# Altium schematic sheet Mainboard.SchDoc
size A4; SheetNumber: 1; SheetTotal: 2
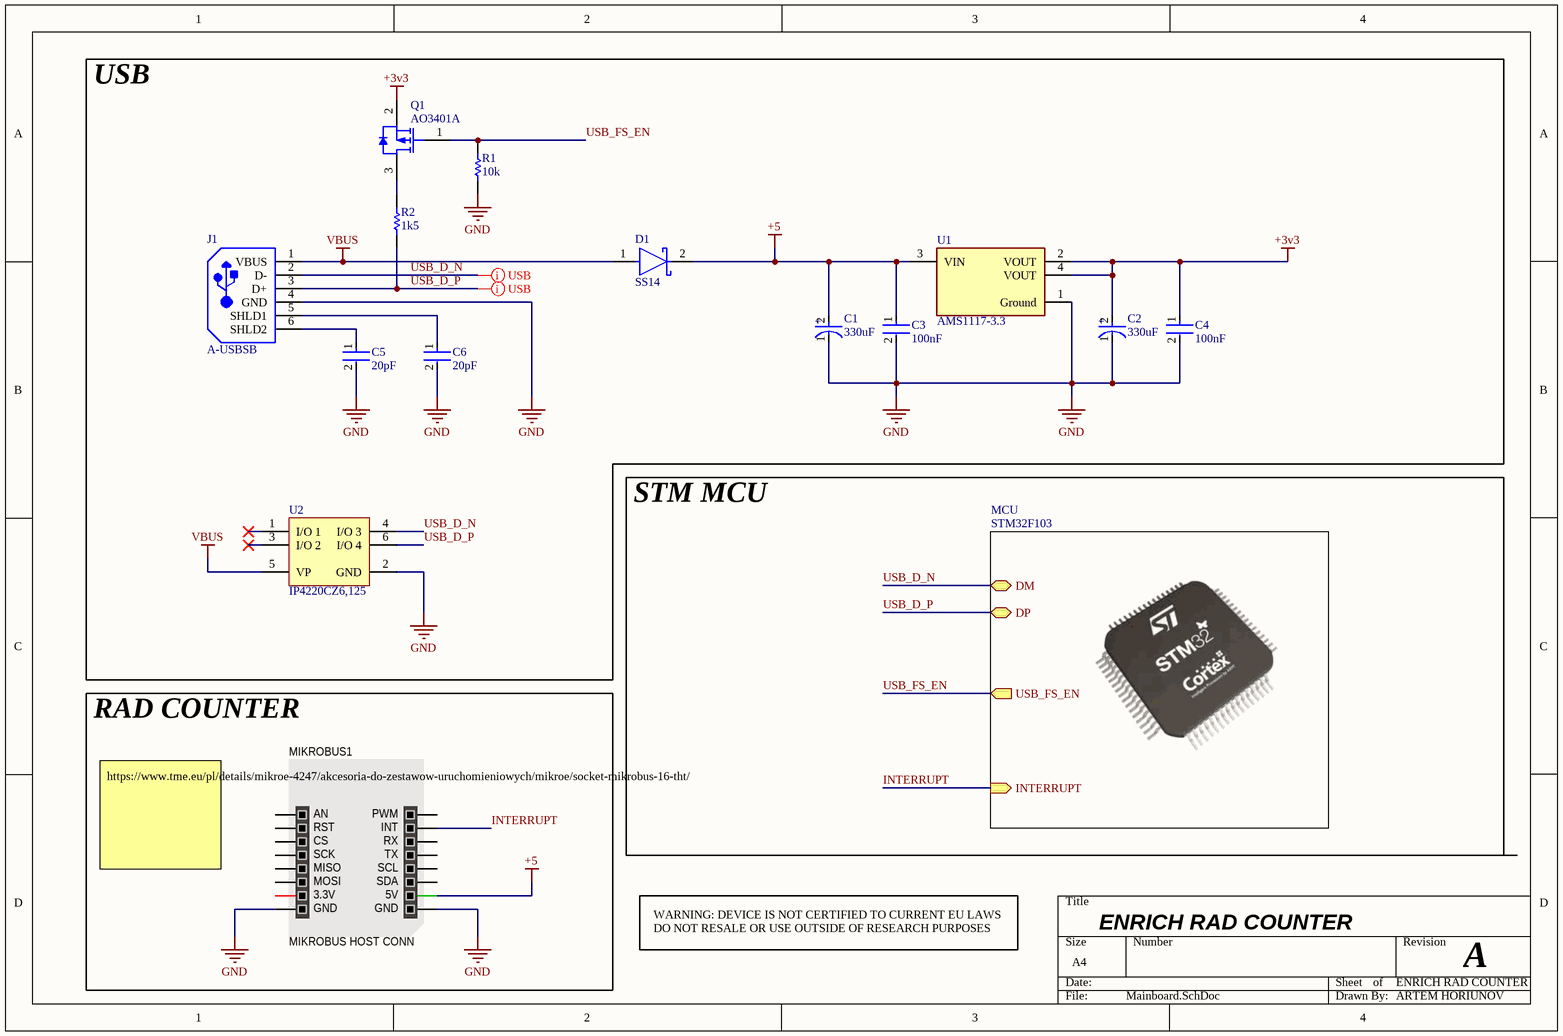
[diagram p0: Mainboard.SchDoc]

## Parts
C1  330uF  [FP-OS-CON-SMT-F12-MFG]
C2  330uF  [FP-OS-CON-SMT-F12-MFG]
C3  100nF  [FP-C0402-BB-MFG]
C4  100nF  [FP-C0402-BB-MFG]
C5  20pF  [FP-C0603C-CF-MFG]
C6  20pF  [FP-C0603C-CF-MFG]
D1  SS14  [FP-403AE-MFG]
J1  A-USBSB  [ASSM-A-USBSB-4_V]
MIKROBUS1  MIKROBUS HOST CONN  [MIKROBUS HOST CONN 8gen TH]
Q1  AO3401A  [AO-SOT-23-3L_V]
R1  10k  [RESC1609X50X30NL8T20]
R2  1k5  [RESC1608X55X30ML15T15]
U1  AMS1117-3.3  [FP-AMS1117-IPC_C]
U2  IP4220CZ6,125  [NXP-SOT457_L]

## Blocks framed on the sheet
USB: C1-C6 D1 J1 Q1 R1 R2 U1 U2
RAD COUNTER: MIKROBUS1

## Sub-sheets
MCU = STM32F103: DM (bidir), DP (bidir), INTERRUPT (in), USB_FS_EN (out)

## Nets
+3v3: C2.2(A) C4.1 Q1.2(SOURCE) U1.2(VOUT) U1.4(VOUT)
+5: C1.2(A) C3.1 D1.2(C) MIKROBUS1.10(5V) U1.3(VIN)
GND: C1.1(C) C2.1(C) C3.2 C4.2 C5.2 C6.2 J1.4(GND) MIKROBUS1.8(GND) MIKROBUS1.9(GND) R1.2 U1.1(Ground) U2.2(GND)
VBUS: D1.1(A) J1.1(VBUS) U2.5(VP)
INTERRUPT: MIKROBUS1.15(INT) ; sheet MCU/INTERRUPT
USB_D_N: J1.2(D-) U2.4(I/O_3) ; sheet MCU/DM
USB_D_P: J1.3(D+) R2.1 U2.6(I/O_4) ; sheet MCU/DP
USB_FS_EN: Q1.1(GATE) R1.1 ; sheet MCU/USB_FS_EN
NetC5_1: C5.1 J1.6(SHLD2)
NetC6_1: C6.1 J1.5(SHLD1)
NetQ1_3: Q1.3(DRAIN) R2.2

Not connected (* = marked no-connect by the designer): MIKROBUS1 1(AN) 2(RST) 3(CS) 4(SCK) 5(MISO) 6(MOSI) 7(3.3V) 11(SDA) 12(SCL) 13(TX) 14(RX) 16(PWM); U2 1(I/O_1)* 3(I/O_2)*

## Layout directives
differential pair: USB_D_N, USB_D_P

## Notes on the sheet
- STM MCU
- https://www.tme.eu/pl/details/mikroe-4247/akcesoria-do-zestawow-uruchomieniowych/mikroe/socket-mikrobus-16-tht/
- WARNING: DEVICE IS NOT CERTIFIED TO CURRENT EU LAWS
- DO NOT RESALE OR USE OUTSIDE OF RESEARCH PURPOSES
- ENRICH RAD COUNTER
- A
- ARTEM HORIUNOV
- (in symbol CMP-2000-05494-3) +

## Library data of the parts
C1 C2 = CMP-2000-05494-3: Conductive Polymer Aluminum Solid Capacitors (OS-CON) 330uF ±20% 16V RADIAL SMT 10x12.6mm; Ripple Current: 4.72A; ESR (Equivalent Series Resistance): 16mR; Polarity: Polar; Dissipation Factor: 15%; Leakage Current: 792uA; Life (Hours): 2000Hour; REACH SVHC: No SVHC; Radiation Hardening: No; Termination: SMD/SMT; Height: 12.6mm; Package Quantity: 400; Capacitance: 330uF; Number of Pins: 12; Height - Seated (Max): 0.5inch; RoHS Compliant: Yes; Tolerance: 20%; Material: Polymer; Packaging: Tape and Reel; Mount: Surface Mount; Lead Free: Lead Free; Voltage Rating: 16V; Diameter: 10mm; Max Operating Temperature: 105°C; Voltage Rating (DC): 16V; Voltage: 16V; Ripple Current (AC): 4.72A; Construction: Cylindrical; Length: 12.6mm; Case/Package: Radial; Min Operating Temperature: -55°C; Series: OS-CON™, SVP
C3 C4 = CMP-2008-02046-2: CAP CER 0.1UF 10V X5R 0402; Manufacturer: Kemet; Manufacturer Part Number: C0402C104K8PACTU; Material: Ceramic; Capacitance: 0.10 μF; Temperature Coefficient: 15%; Tolerance: 0.1; Value: 0.10 μF; Package: C0402-BB; Temperature: -55°C to +125°C; ComponentLink2Description: Datasheet; Temperature Characteristic: X5R; Device Class L1: Passive Components; Height: 0.55mm; Lead Free: Yes; ComponentLink2URL: https://content.kemet.com/datasheets/KEM_C1002_X7R_SMD.pdf; Device Class L2: Capacitors; Temperature Range Low: -55°C; Temperature Range High: +125°C; RoHS: TRUE; Octopart: https://octopart.com/c0402c104k8pactu-kemet-140039; Automotive: No; Mouser Description: Capacitor 100 nF 10 VDC 0402; Category: Cap; Voltage Rating: 10 V; Digikey Description: CAP CER 0.1UF 10V X5R 0402; Ipc Land Pattern Name: CAPC10050X50; Device Class L3: Ceramic Capacitors
C5 C6 = CMP-1035-00783-3: CAP CER 20PF 50V 5% NP0 0603; Manufacturer Part Number: C0603C200J5GACTU; Manufacturer: KEMET; Temperature Coefficient: 30ppm/°C; Temperature Characteristic: C0G; Automotive Grade: Grade 1; Tolerance: 0.05; Material: Ceramic; Category: Cap; Temperature Range Low: -55°C; RoHS: TRUE; ComponentLink2URL: https://api.kemet.com/component-edge/download/datasheet/C0603C100J5GACAUTO.pdf; Package: C0603C-CF; Height: 0.87mm; Capacitance: 20 pF; Voltage Rating: 50 V; Octopart: https://octopart.com/c0603c200j5gactu-kemet-9138585; Device Class L1: Passive Components; Automotive: Yes; Digikey Description: CAP CER 20PF 50V 5% NP0 0603; Temperature Range High: +125°C; Device Class L3: Ceramic Capacitors; Mouser Description: Multilayer Ceramic Capacitors MLCC - SMD/SMT 50volts 20pF C0G 5%; ComponentLink2Description: Datasheet; Device Class L2: Capacitors; Lead Free: Yes; Temperature: -55°C to +125°C; Value: 20 pF
D1 = CMP-2000-04943-2: DIODE SCHOTTKY 40V 1A SMA; Manufacturer: ON Semiconductor; Peak Reverse Current: 0.2mA; Max Junction Temp: +125°C; Standoff Height: 0.05mm; Max Surge Forward Current: 40A; Mouser Description: Schottky Diodes & Rectifiers SMA 40V 1.0A; RoHS: TRUE; Lead Free: Yes; Manufacturer Part Number: SS14; Device Class L3: Schottky Diodes; Category: Diode; Automotive: No; Digikey Description: DIODE SCHOTTKY 40V 1A SMA; ComponentLink2Description: Datasheet; Device Class L2: Diodes; Height: 2.5mm; Temperature Range High: +125°C; ComponentLink2URL: https://www.onsemi.com/pub/Collateral/SS19-D.PDF; Device Class L1: Discrete Semiconductors; Package: 403AE; Octopart: https://octopart.com/ss14-on+semiconductor-29205033; Max Repetitive Reverse Voltage: 40V; Temperature Range Low: -65°C; Forward Current: 1A; Temperature: -65°C to +125°C
J1 = CMP-2000-05874-1: Connector Receptacle, USB Type B, Right Angle, -20 to 85 degC, 4-Pin THD, RoHS, Tray; Manufacturer: ASSMANN WSW; Gender: Female; CAD Drawing: 3DCADModel; Number of Ports: 1; Mounting Type: ThroughHole; Datasheet URL: https://datasheet.ciiva.com/11731/0900766b80da421f-11731321.pdf; Datasheet Version: 12/2009; Manufacturer URL: http://www.assmann.us/; Package Description: 4-Pin Through Hole Device, Body 16.5 x 12.04 mm; Body Orientation: RightAngle; Mounting Technology: ThroughHole; Package Reference: USBSB; Termination Method: Solder
Q1 = CMP-2000-05778-1: P-Channel MOSFET, 30 V, 4 A, -55 to 150 degC, 3-Pin SOT-23-3L, RoHS, Tape and Reel; Manufacturer: Alpha and Omega; Output Power (Max): NotRequiredW; Power Dissipation: 1.4W; Rad Hardened: No; Drain Efficiency: NotRequired%; Drain-Source On-Volt: 30V; Noise Figure: NotRequireddB; Frequency (Max): NotRequiredMHz; Number of  Elements: 1; Gate-Source Voltage (Max): ?12V; Drain Current (Max): 4A; Channel Mode: Enhancement; Drain-Source On-Res: 0.044ohm; Type: PowerMOSFET; Polarity: P; Package URL: http://www.aosmd.com/res/packaging_information/SOT-23-3L.pdf; Datasheet URL: http://www.aosmd.com/res/data_sheets/AO3401A.pdf; Package Type: SOT-23; Package Description: 3-Pin Small Outline Transistor, Body 2.95 x 1.6 mm, Pitch 0.95 mm; Mounting: SurfaceMount; Manufacturer URL: http://www.aosmd.com/; Continuous Drain Current: 4A; Package Reference: SOT-23-3L; Mounting Technology: SurfaceMount; Operating Temperature Classification: Military; Power Gain: NotRequireddB; Datasheet Version: Rev. 3, 03/2011; Operating Temp Range: -55Cto150C; Pin Count: 3
R1 = CMP-1666-00005-4: Chip Resistor, 10 KOhm, +/- 1%, 100 mW, -55 to 155 degC, 0603 (1608 Metric), RoHS, Tape and Reel; Manufacturer: Vishay Semiconductor; Voltage Rating: 75 V; Max Operating Temperature: 155 degC; PackageDescription: 2-Pin Surface Mount Device, Body 1.575 x 0.85 mm; ComponentLink1Description: Manufacturer URL; RoHSCompliant: true; PackageReference: 0603; REACH SVHC: Unknown; Length: 1.55 mm; DatasheetVersion: 06/2012; Packaging: Tape and Reel; Min Operating Temperature: -55 degC; Mounting Technology: Surface Mount; ComponentLink2URL: https://datasheet.ciiva.com/11809/0900766b80d98afc-11809037.pdf; Height: 0.45 mm; ComponentLink2Description: Datasheet; Package Quantity: 5000; ComponentLink1URL: http://www.vishay.com/
R2 = CMP-1012-00528-2: Part Number: ERJ-3EKF1501V; Manufacturer: Panasonic
U1 = CMP-209535-000001-1: LDO Voltage Regulators 1A, 3.3V; Manufacturer: Advanced Monolithic Systems; Dropout Voltage: 1.1V; Output Type: Fixed; Nominal Supply Current: 5mA; Max Power Dissipation: 1.2W; Max Supply Voltage: 15V; Number Of Outputs: 1; Standoff Height: 0.64mm; Max Junction Temp: +125°C; Height: 1.8mm; Package: AMS1117; Device Class L2: Power Management ICs; ComponentLink2Description: Datasheet; ComponentLink2URL: http://www.advanced-monolithic.com/pdf/ds1117.pdf; Category: IC; RoHS: TRUE; Automotive: No; Device Class L1: Integrated Circuits (ICs); Output Current: 1A; Device Class L3: Voltage Regulators - Linear; Temperature: -40°C to +125°C; Output Voltage: 3.3V; Manufacturer Part Number: AMS1117-3.3; Temperature Range Low: -40°C; Octopart: https://octopart.com/ams1117-3.3-advanced+monolithic+systems-25899300; Lead Free: Yes; Ipc Land Pattern Name: SOT229P700X180-4; Temperature Range High: +125°C
U2 = CMP-2000-06457-1: Dual USB 2.0 integrated ESD protection, 0 to 5.5 V, -40 to 85 degC, 6-Pin TSOP (SOT457), RoHS, Tape and Reel; Manufacturer: NXP Semiconductors; Product Height (mm): 1mm; Rad Hardened: No; Package Version: 06-03-16, 03/2006; Product Length (mm): 3.1mm; VIN Max: 5.5V; Configuration: Quad; Suppressor Type: DiodeArrays; Number of Channels: 4; VF: 0.7V; Capacitance Value: 1.2pF; Product Depth (mm): 1.7mm; VIN Min: 0V; Leakage Current (Max): 0.1uA; ESD Protection Voltage: 8KV@ContactDisc; Direction Type: Uni-Directional; Manufacturer URL: http://www.nxp.com/; Package Reference: SOT457; Datasheet URL: http://cache.nxp.com/documents/data_sheet/IP4220CZ6.pdf; Operating Temperature Max Deg. C: 85C; Packaging: TapeandReel; Package Description: 6-Pin Thin Small Outline Package, Body 2.9 x 1.5 mm, Pitch 0.95 mm; PartNumber: IP4220CZ6; Mounting Technology: SurfaceMount; Working Voltage (Max): 5.5V; Operating Temperature Min Deg. C: -40C; Working Voltage: 5.5V; Package / Case: TSOP; Package URL: http://www.nxp.com/documents/outline_drawing/sot457_po.pdf; Leakage Current: 0.1uA; Pin Count: 6; Mounting Style: SurfaceMount; Datasheet Version: Rev. 5, 07/2011